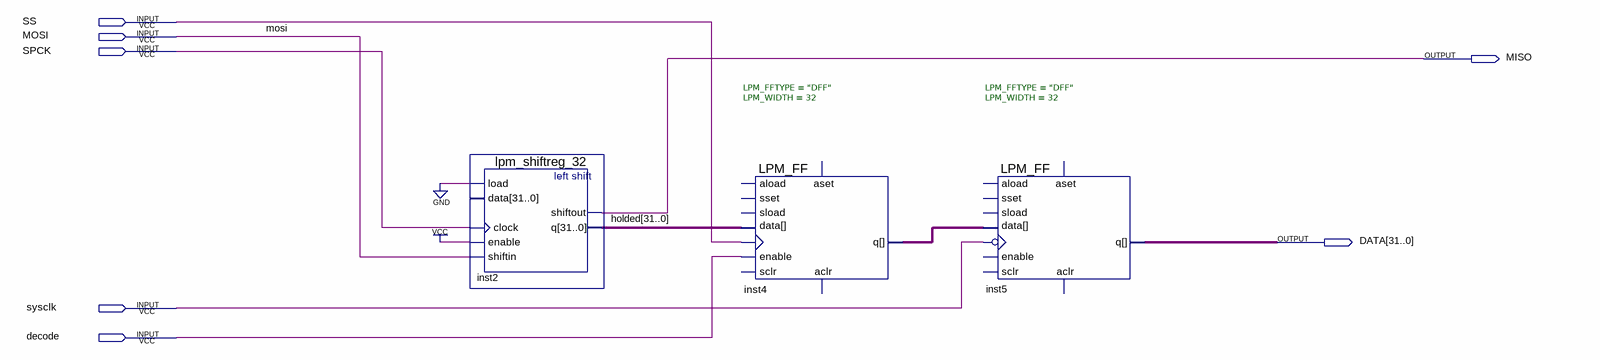
[diagram p0: schematic sheet]
// Quartus schematic spislave_sync.bdf as structural Verilog: 3 symbols, 7 pins
module spislave_sync (
  input  SS,
  input  MOSI,
  input  SPCK,
  input  sysclk,
  input  decode,
  output MISO,
  output [31:0] DATA
);

  wire [31:0] holded, inst4_q;

  lpm_shiftreg_32 inst2 (
    .load(1'b0), .clock(SPCK), .enable(1'b1), .shiftin(MOSI), .shiftout(MISO), .q(holded));  // open: data
  LPM_FF #(.LPM_FFTYPE("DFF"), .LPM_WIDTH(32)) inst4 (
    .clock(SS), .data(holded), .enable(decode), .q(inst4_q));  // open: aclr, aload, aset, sclr, sload, sset
  LPM_FF #(.LPM_FFTYPE("DFF"), .LPM_WIDTH(32)) inst5 (
    .clock(~sysclk), .data(inst4_q), .q(DATA));  // open: aclr, aload, aset, enable, sclr, sload, sset
endmodule
